# Altium schematic sheet 大直-絕境擴散-解藥機.SchDoc
size A3
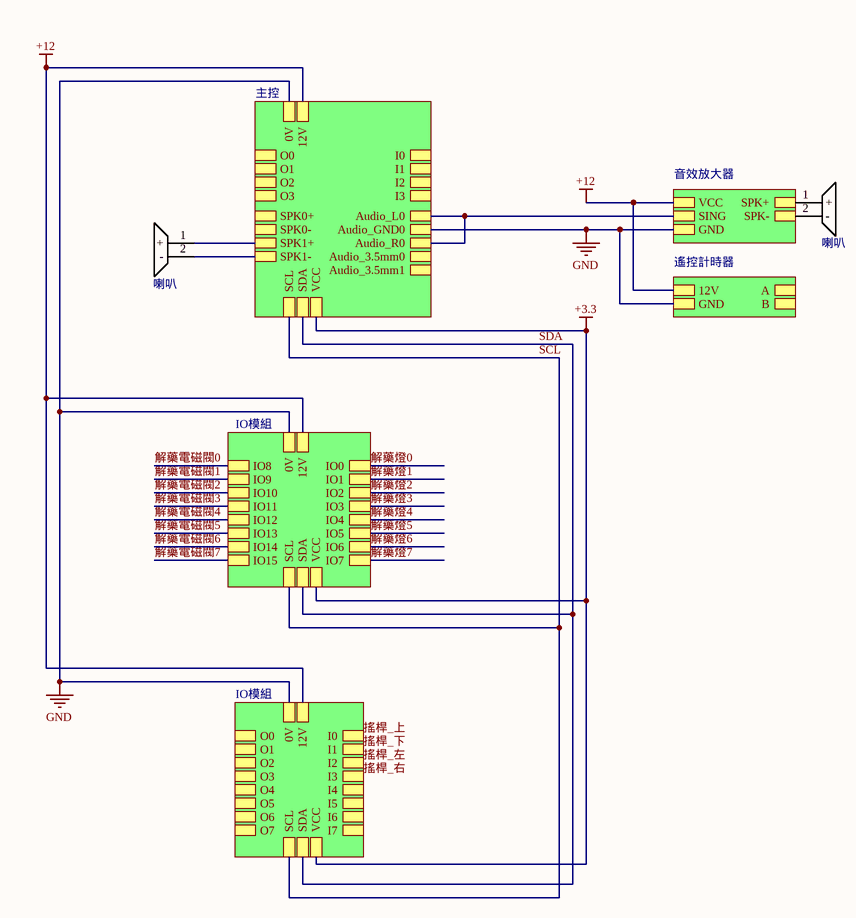
[diagram p0: 大直-絕境擴散-解藥機.SchDoc]

## Parts
B44  喇叭  [Buzzer_12085]
B45  喇叭  [Buzzer_12085]

## Sub-sheets
IO模組 = IO模組_MCP23017_20240812.SchDoc: O5, O7, O3, I6, I7, O4, O1, I0, I1, I2, I3, I4, I5, O6, O2, O0, VCC, 12V, 0V, SCL, SDA
IO模組 = IO模組_MCP23017_20240819.SchDoc: VCC, 12V, 0V, SCL, SDA, IO15, IO14, IO10, IO0, IO3, IO4, IO5, IO8, IO11, IO6, IO7, IO12, IO13, IO2, IO1, IO9
主控 = ESP32主控_20240812.SchDoc: 12V, SDA, VCC, 0V, SCL, O3, O2, O1, O0, I3, I2, I1, I0, SPK0+, Audio_3.5mm1, Audio_L0, SPK0-, Audio_R0, SPK1+, SPK1-, Audio_3.5mm0, Audio_GND0
遙控計時器 = File Name: 12V, GND, B, A
音效放大器 = File Name: VCC, SING, GND, SPK-, SPK+

## Nets
+3.3: sheet 主控/VCC, sheet IO模組/VCC, sheet IO模組/VCC
+12: sheet 主控/12V, sheet IO模組/12V, sheet 音效放大器/VCC, sheet 遙控計時器/12V, sheet IO模組/12V
GND: sheet 主控/0V, sheet 主控/Audio_GND0, sheet IO模組/0V, sheet 音效放大器/GND, sheet 遙控計時器/GND, sheet IO模組/0V
SCL: sheet 主控/SCL, sheet IO模組/SCL, sheet IO模組/SCL
SDA: sheet 主控/SDA, sheet IO模組/SDA, sheet IO模組/SDA
搖桿_上: sheet IO模組/I0
搖桿_下: sheet IO模組/I1
搖桿_右: sheet IO模組/I3
搖桿_左: sheet IO模組/I2
解藥燈0: sheet IO模組/IO0
解藥燈1: sheet IO模組/IO1
解藥燈2: sheet IO模組/IO2
解藥燈3: sheet IO模組/IO3
解藥燈4: sheet IO模組/IO4
解藥燈5: sheet IO模組/IO5
解藥燈6: sheet IO模組/IO6
解藥燈7: sheet IO模組/IO7
解藥電磁閥0: sheet IO模組/IO8
解藥電磁閥1: sheet IO模組/IO9
解藥電磁閥2: sheet IO模組/IO10
解藥電磁閥3: sheet IO模組/IO11
解藥電磁閥4: sheet IO模組/IO12
解藥電磁閥5: sheet IO模組/IO13
解藥電磁閥6: sheet IO模組/IO14
解藥電磁閥7: sheet IO模組/IO15
NetB44_1: B44.1(+) ; sheet 音效放大器/SPK+
NetB44_2: B44.2(-) ; sheet 音效放大器/SPK-
NetB45_1: B45.1(+) ; sheet 主控/SPK1+
NetB45_2: B45.2(-) ; sheet 主控/SPK1-
(unnamed): sheet 主控/Audio_L0, sheet 主控/Audio_R0, sheet 音效放大器/SING

## Library data of the parts
B44 B45 = Buzzer: 無源蜂鳴器